# EasyEDA Pro project Magmattic PCB_V2.eprj, board AmpOnly1
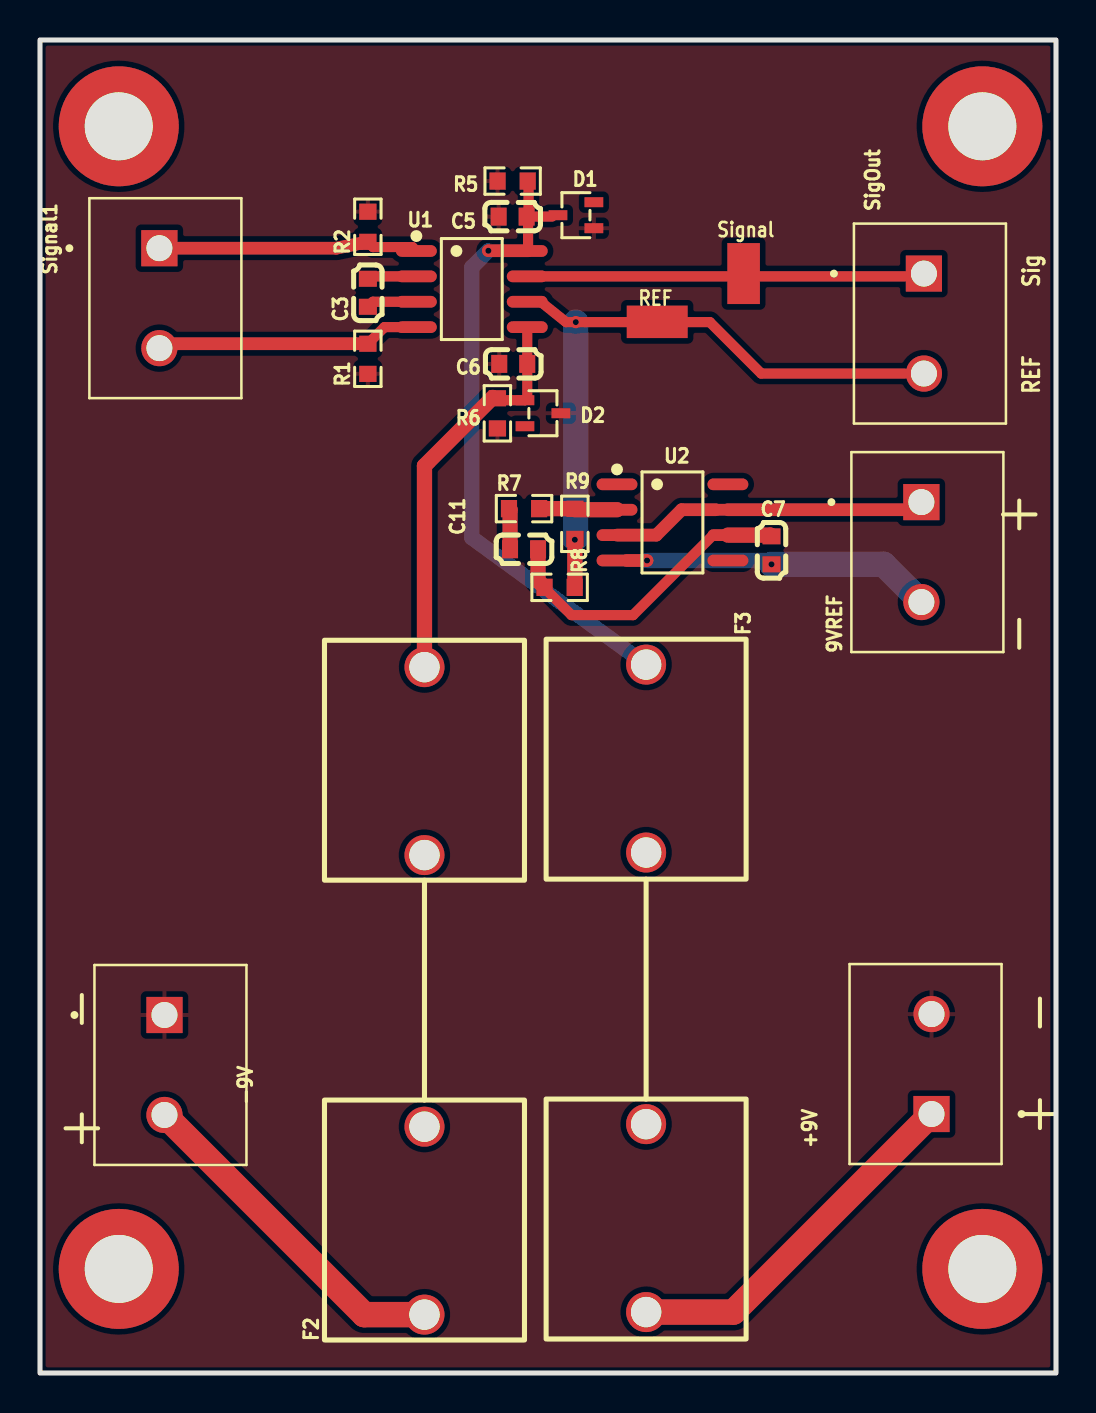
[diagram p16: board, top side]
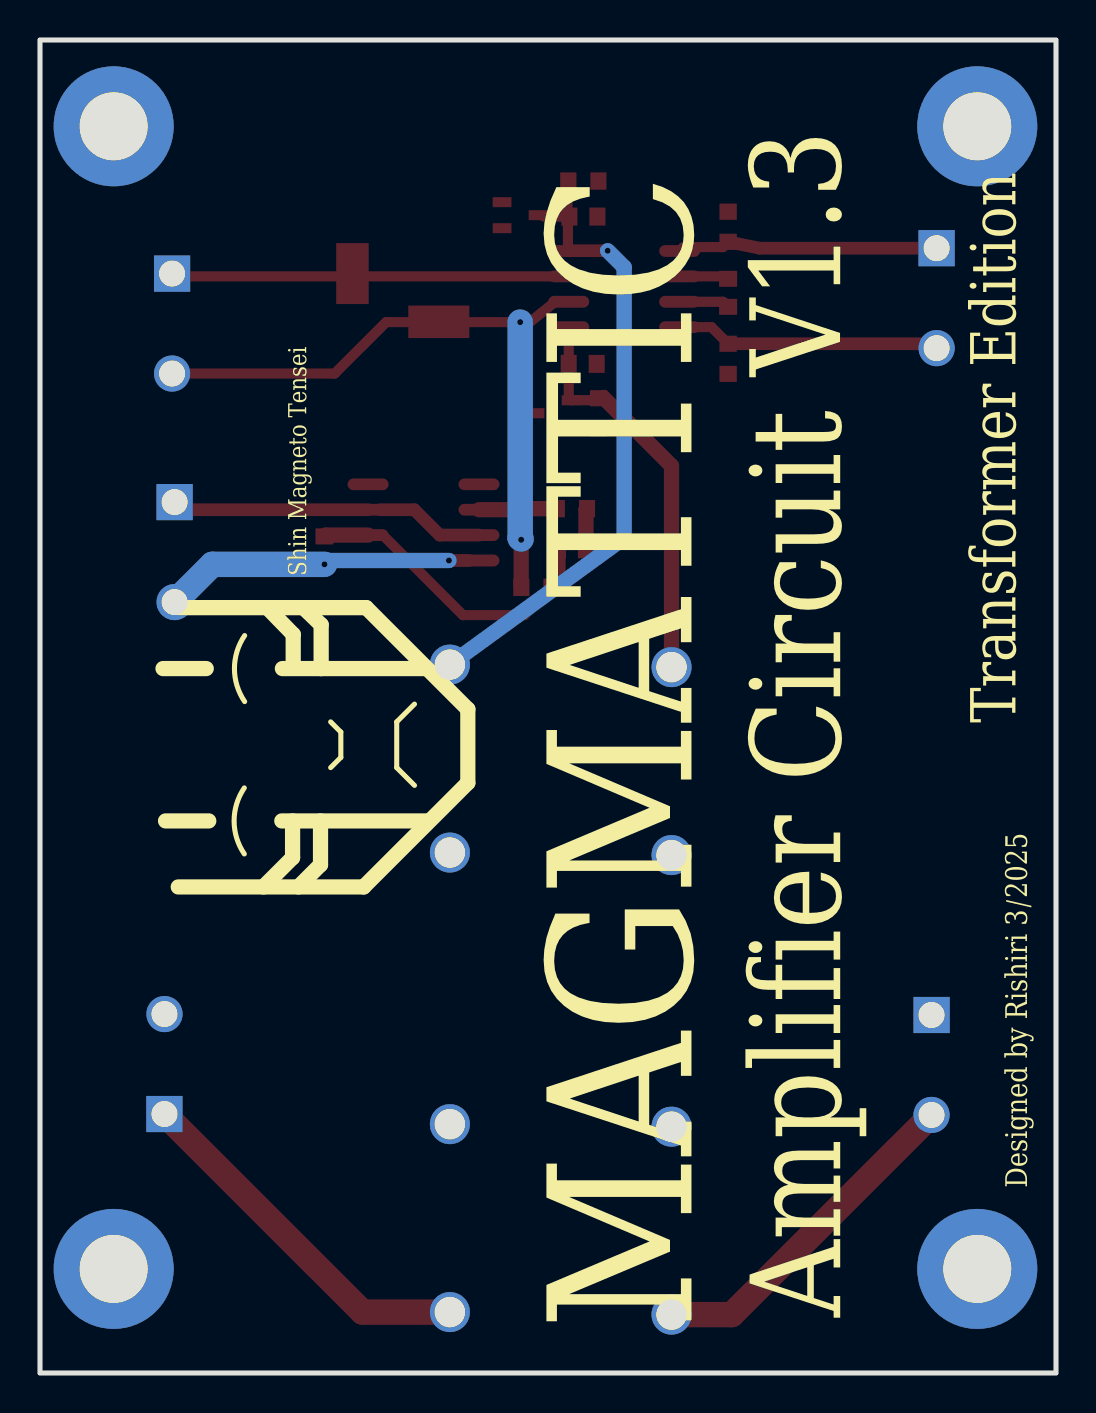
[diagram p17: board, bottom side, seen from below]

Outline 50.8 x 66.67 mm; copper layers: Top Layer, Bottom Layer. Coordinates in mm from the lower left corner of the outline.
Outline path: rectangle 0,66.67 50.8,0
Stack: Top Layer 0.035mm / Dielectric1 1.51mm FR4 er 4.5 / Bottom Layer 0.035mm

## Design rules (mm)
template: Custom Config
spacing copperThickness1oz (default): track to track 0.152, other pairs 0.152 to 0.3
spacing copperThickness2oz: track to track 0.203, other pairs 0.152 to 0.3
track width copperThickness1oz (default): min 0.127, default 0.254, max 2.54
track width copperThickness2oz: min 0.203, default 0.254, max 2.54
differential pair differentialPair (default): width min 0.127, default 0.254, max 2.54; gap min 0.152, default 0.152
via viaSize (default): diameter min 0.5, default 0.61, max 10; hole min 0.3, default 0.305, max 6.3

## Placement (name value [footprint] x y rotation side)
9VREF  Output  [CUI_TB002-500-02BE]  44.07 43.56 270 top
+9V  Output  [CUI_TB002-500-02BE]  44.58 12.95 90 top
-9V  Output  [CUI_TB002-500-02BE]  6.22 17.91 270 top
C3  47nF  [C0603]  16.39 54.03 90 top
C5  .1u  [C0603]  23.63 57.84 0 top
C6  .1u  [C0603]  23.66 50.47 0 top
C7  10u  [C0603]  36.58 41.15 270 top
C11  39nF  [C0603]  24.2 41.2 180 top
D1  BZX84W-C27F  [SOT-323-3_L2.0-W1.3-P1.30-LS2.1-BR]  26.8 57.91 0 top
D2  BZX84W-C27F  [SOT-323-3_L2.0-W1.3-P1.30-LS2.1-BR]  25.15 48.01 180 top
F2  -  [10mA Fuse]  14.22 1.65 90 top
F3  -  [10mA Fuse]  35.31 36.7 270 top
NOREF  -  [Pad_e154]  35.18 54.99 270 top
NOREF#2  -  [Pad_e87]  47.12 5.21 0 top
NOREF#3  -  [Pad_e80]  3.94 62.36 0 top
NOREF#4  -  [Pad_e86]  3.94 5.21 0 top
NOREF#5  -  [Pad_e156]  30.86 52.58 180 top
NOREF#6  -  [Pad_e88]  47.12 62.36 0 top
R1  100k  [R0603]  16.39 50.73 90 top
R2  100k  [R0603]  16.39 57.33 90 top
R5  3300  [R0603]  23.63 59.62 0 top
R6  3300  [R0603]  22.87 48 90 top
R7  10k  [R0603]  24.2 43.23 0 top
R8  37.4  [R0603]  25.98 39.3 180 top
R9  1k  [R0603]  26.74 42.47 90 top
Signal1  Signal  [CUI_TB002-500-02BE]  5.97 56.26 270 top
SigOut  Output  [CUI_TB002-500-02BE]  44.2 54.99 270 top
U1  INA848IDR  [SOIC-8_L4.9-W3.9-P1.27-LS6.0-BL]  21.59 54.22 270 top
U2  OPA197IDR  [SOIC-8_L4.9-W3.9-P1.27-LS6.0-BL]  31.62 42.55 270 top

## Footprints (pads in the part's own frame, mm; a bottom-side part is the same pattern mirrored in y, then rotated)
10mA Fuse
  round 2 hole 1.52: 1(1.27,-5) 2(10.67,-5) 3(24.255,-5) 4(33.655,-5)
C0603
  rect 0.8x0.9 smd: 1(-0.7,0) 2(0.7,0)
CUI_TB002-500-02BE
  rect 1.808x1.808 hole 1.3: 1(0,0)
  round 1.808 hole 1.3: 2(5,0)
Pad_e80
  round 6 hole 3.4: 1(0,0)
Pad_e86
  round 6 hole 3.4: 1(0,0)
Pad_e87
  round 6 hole 3.4: 1(0,0)
Pad_e88
  round 6 hole 3.4: 1(0,0)
Pad_e154
  rect 3.048x1.625 smd: TP3(0,0)
Pad_e156
  rect 3.048x1.625 smd: TP3(0,0)
R0603
  rect 0.806x0.864 smd: 1(-0.753,0) 2(0.753,0)
SOIC-8_L4.9-W3.9-P1.27-LS6.0-BL
  oval 0.588x2.045 smd: 1(-1.905,-2.772) 2(-0.635,-2.772) 3(0.635,-2.772) 4(1.905,-2.772) 5(1.905,2.772) 6(0.635,2.772) 7(-0.635,2.772) 8(-1.905,2.772)
SOT-323-3_L2.0-W1.3-P1.30-LS2.1-BR
  rect 0.936x0.5 smd: 1(0.898,-0.65) 2(0.898,0.65) 3(-0.898,0)

## Nets
As in the schematic, except:
REF: NOREF#5.TP3 R8.1 R9.1 SigOut.2 U1.6
$1N3596: NOREF.TP3 SigOut.1 U1.7

Pads without a net: D1 2; D2 2; F2 2 3; F3 2 3; NOREF#2 1; NOREF#3 1; NOREF#4 1; NOREF#6 1; U2 1 5 8

## Via types
v1: diameter 0.61, hole 0.305, Top Layer to Bottom Layer, 5 vias

## Routing (per net, layer and track width the routed paths; a pad name or vN(x,y) marks a point on that pad's centre or on a via; arc(x,y) is an arc through that point)
BB-ADS1262-REV.A_GNDD: length 15.6
  Top Layer w0.635: v1(30.35,40.64) 29.34,40.64
  Bottom Layer w0.762: v1(30.35,40.64) 36.38,40.64 v1(36.58,40.45)
  Bottom Layer w1.27: v1(36.58,40.45) 42.18,40.45 9VREF.2
IN+: length 13.3
  Top Layer w0.508: U1.4 17.22,52.31 R1.2
  Top Layer w0.635: Signal1.2 6.19,51.48 R1.2
IN-: length 13.1
  Top Layer w0.508: R2.1 16.66,56.32 18.62,56.32 U1.1
  Top Layer w0.635: Signal1.1 14.81,56.26 R2.1
REF: length 32.9
  Top Layer w0.508: 25.02,53.59 26.3,52.56 33.49,52.56 36.06,49.99 43.23,49.99
  Top Layer w0.762: v1(26.74,41.68) 26.74,39.3
  Bottom Layer w1.27: R9.1 26.79,41.77 v1(26.79,52.56)
$1N821: length 32.4
  Top Layer w0.508: 25.6,57.84 C5.2 24.43,57.94 24.43,59.62 ; 24.4,57.91 24.4,56.16
  Top Layer w0.635: v1(22.42,56.13) 24.4,56.13
  Top Layer w1.27: F3.1 30.36,35.49
  Bottom Layer w0.762: v1(22.42,56.13) 21.59,55.31 21.59,41.78 F3.1
$1N826: length 2.5
  Top Layer w0.508: U1.2 16.51,54.85 C3.2
$1N829: length 2.5
  Top Layer w0.508: C3.1 16.64,53.58 U1.3
9VREF: length 15.3
  Top Layer w0.635: U2.3 30.81,41.91 32.08,43.18 33.78,43.18 ; U2.7 43.69,43.18 9VREF.1
$1N3596: length 18.4
  Top Layer w0.508: 25,54.85 43.42,54.85
$1N6194: length 17.1
  Top Layer w1.27: -9V.2 16.21,2.92 F2.1
$1N6926: length 20
  Top Layer w0.508: 22.87,48.75 22.97,48.66 D2.1 24.36,48.77 U1.5
  Top Layer w0.762: 22.64,48.8 19.22,45.38 19.22,35.31
$1N8365: length 14.9
  Top Layer w0.508: 25.19,39.3 26.58,37.91 29.65,37.91 33.65,41.91
  Top Layer w0.762: C11.1 24.9,39.62 R8.2 ; U2.6 36.51,41.91 C7.1
$1N8366: length 3.9
  Top Layer w0.762: R7.2 26.73,43.23 R9.2 ; U2.2 26.74,43.18
$1N8369: length 2.1
  Top Layer w0.762: R7.1 23.5,43.18 C11.2
$1N9226: length 18.4
  Top Layer w1.27: F3.4 34.67,3.05 +9V.1

## Copper pours and planes (outline as drawn; the poured copper is in the pictures)
AMPGND on Top Layer: 0,66.67 50.8,66.67 50.8,0 0,0

## Text on the board
Bottom Silkscreen Layer: Shin Magneto Tensei | Designed by Rishiri 3/2025 | Transformer Edition | Amplifier Circuit V1.3 | MAGMATTIC
Top Silkscreen Layer: REF | Signal | Sig | + | -
